# EasyEDA Pro project SAM-2.eprj, board SAM-25
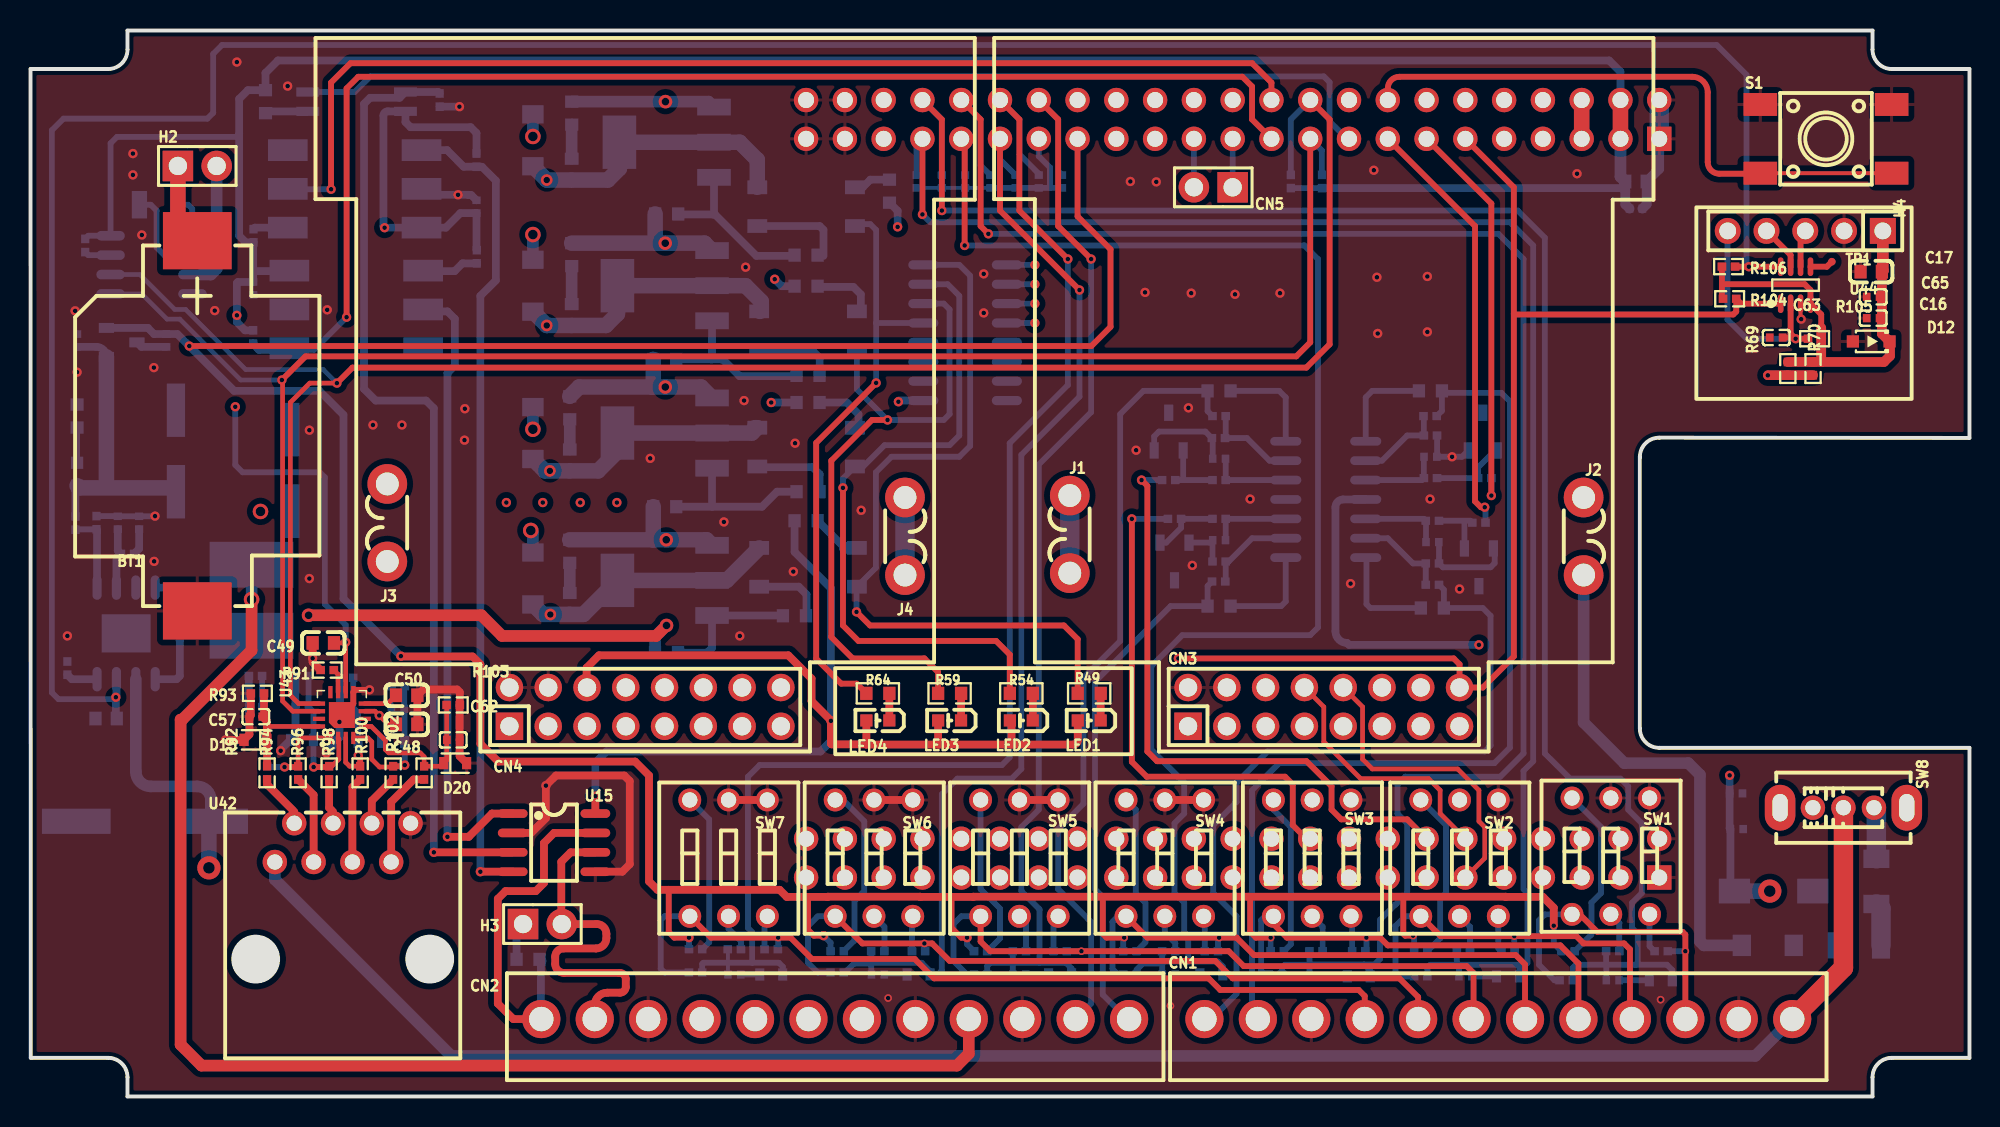
[diagram p20: board, top side]
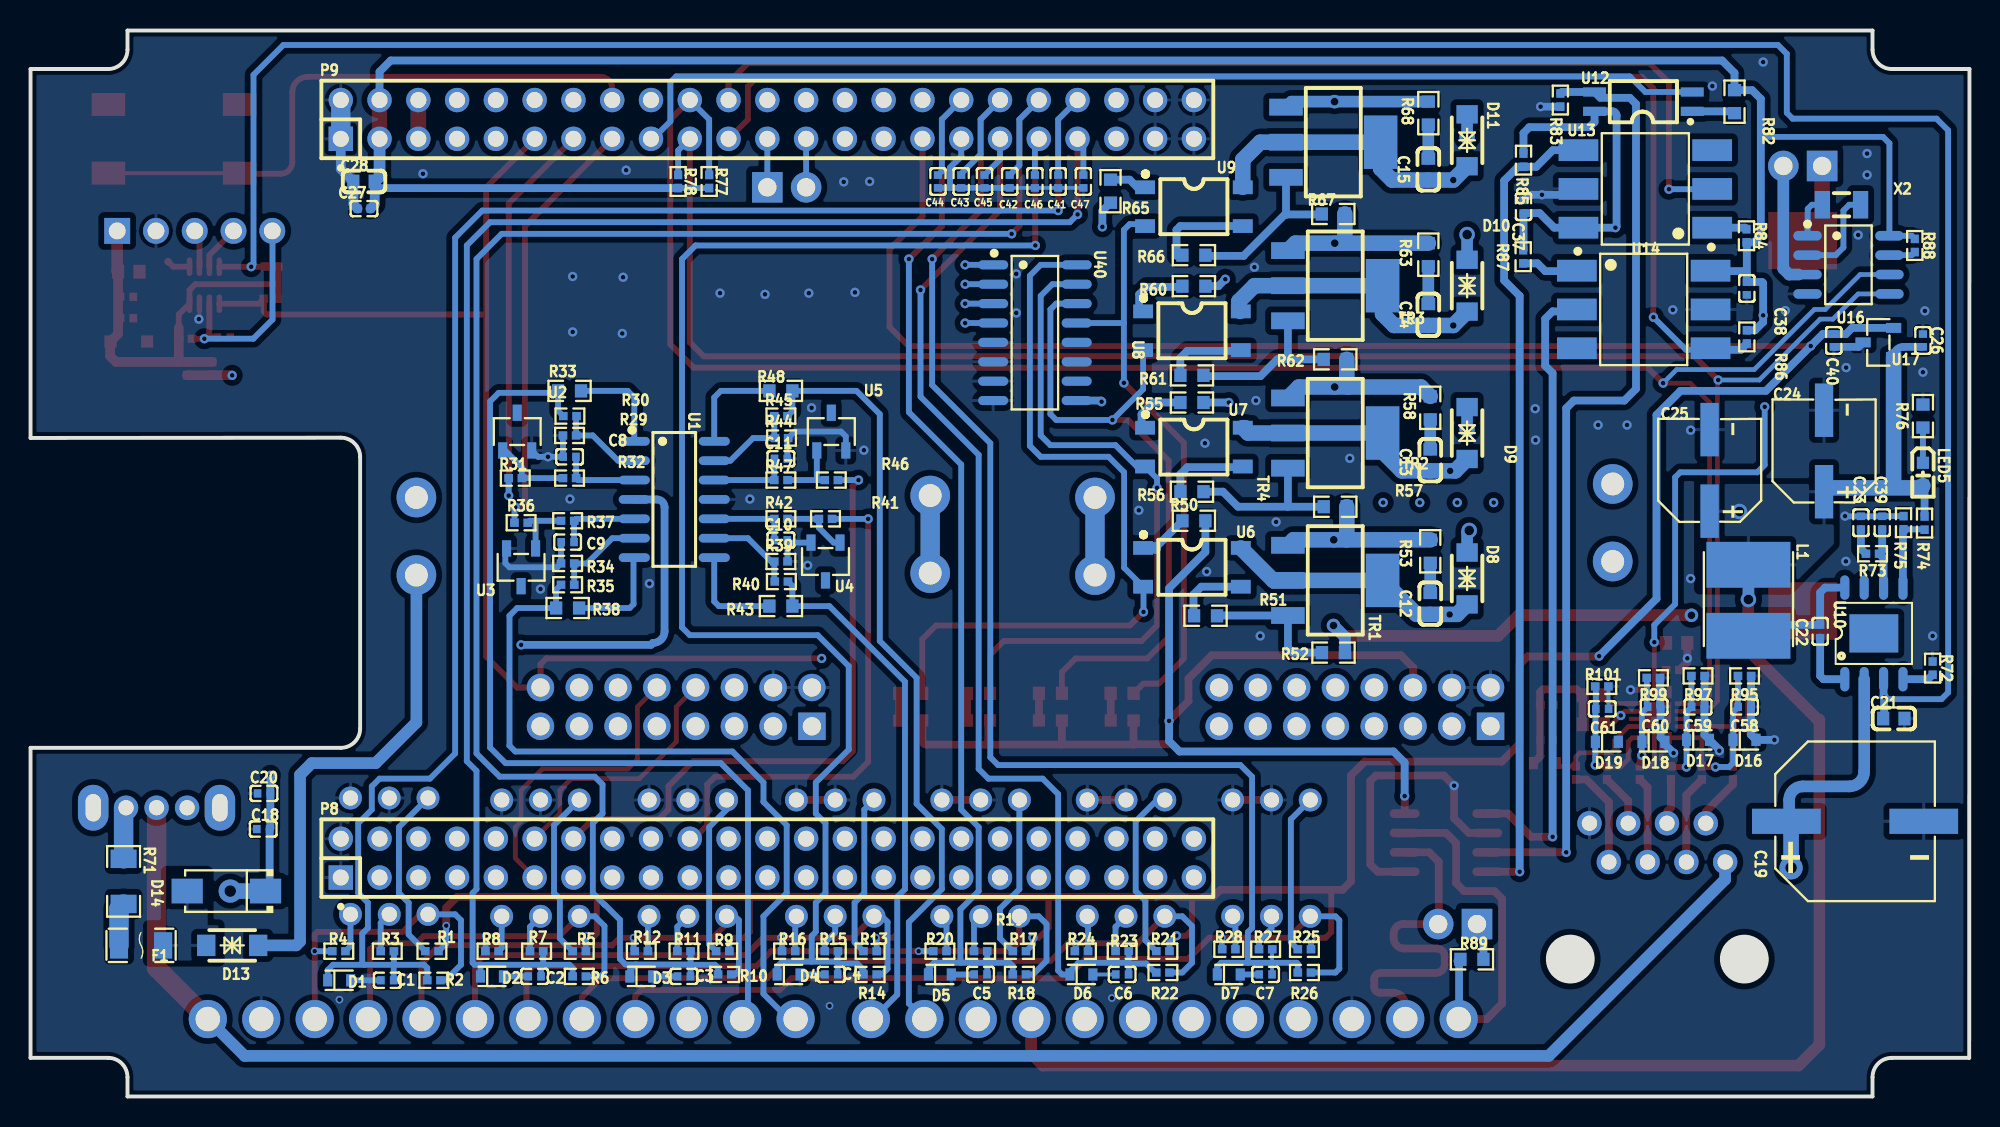
[diagram p21: board, bottom side, seen from below]

Outline 127 x 69.82 mm; copper layers: Top Layer, Inner1, Inner2, Bottom Layer. Coordinates in mm from the lower left corner of the outline.
Outline path: 0,67.3 0.02,2.53 5.08,2.53 arc(5.98,2.16) 6.35,1.26 6.35,0 120.65,0 120.65,1.26 arc(121.02,2.16) 121.92,2.53 127,2.53 127,22.84 106.68,22.84 arc(105.78,23.21) 105.41,24.11 105.41,41.88 arc(105.78,42.78) 106.68,43.15 127,43.14 127,67.3 121.92,67.3 arc(121.02,67.67) 120.65,68.57 120.65,69.82 6.35,69.82 6.35,68.57 arc(5.98,67.67) 5.08,67.3 0,67.3
Stack: Top Layer 0.035mm Outer layer thickness 1oz / Dielectric1 0.2104mm 7628 RC49% 8.6mil / Inner1 0.0152mm Inner layer thickness / Dielectric2 1.065mm 1.1mm H/HOZ Copper / Inner2 0.0152mm Inner layer thickness / Dielectric3 0.2104mm 7628 RC49% 8.6mil / Bottom Layer 0.035mm Outer layer thickness 1oz

## Design rules (mm)
net B+: DP1
net B-: DP1
template: Custom Config
spacing copperThickness1oz (default): track to track 0.102, other pairs 0.152 to 0.3
spacing copperThickness2oz: track to track 0.203, other pairs 0.152 to 0.3
spacing copperThicknessInner0.5oz: track to track 0.089, other pairs 0.152 to 0.3
track width copperThickness1oz (default): min 0.102, default 0.254, max 2.54
track width copperThickness2oz: min 0.203, default 0.254, max 2.54
track width copperThickness0.5oz: min 0.089, default 0.254, max 2.54
differential pair differentialPair (default): width min 0.127, default 0.254, max 2.54; gap min 0.152, default 0.152
via viaSize (default): diameter min 0.3, default 0.61, max 10; hole min 0.2, default 0.305, max 6.3

## Placement (name value [footprint] x y rotation side)
BT1  BS-16-B4AK003  [BAT-SMD_BS-16-B4AK005]  10.92 43.93 90 top
C1  100nF  [C0402]  103.63 7.61 180 bottom
C2  100nF  [C0402]  93.98 7.86 180 bottom
C3  100nF  [C0402]  84.2 7.86 180 bottom
C4  100nF  [C0402]  74.55 7.99 180 bottom
C5  100nF  [C0402]  64.77 7.99 180 bottom
C6  100nF  [C0402]  55.5 7.99 180 bottom
C7  100nF  [C0402]  46.1 7.99 180 bottom
C8  10uF  [C0402]  91.69 41.9 180 bottom
C9  10uF  [C0402]  91.82 36.31 180 bottom
C10  10uF  [C0402]  77.85 36.44 0 bottom
C11  10uF  [C0402]  77.85 41.77 0 bottom
C12  10nF  [C0603]  35.32 32.28 270 bottom
C13  10nF  [C0603]  35.32 41.68 270 bottom
C14  10nF  [C0603]  35.44 51.2 270 bottom
C15  10nF  [C0603]  35.44 60.73 270 bottom
C16  100nF  [C0402]  120.69 50.98 0 top
C17  1uF  [C0603]  120.56 54.03 0 top
C18  220nF  [C0402]  111.76 17.52 180 bottom
C19  330uF  [CAP-SMD_BD10.0-L10.3-W10.3-LS11.3-FD]  7.49 18.02 180 bottom
C20  100nF  [C0402]  111.71 19.85 180 bottom
C21  1uF  [C0603]  4.95 24.76 0 bottom
C22  100nF  [C0402]  9.78 30.47 270 bottom
C23  3.3nF  [C0402]  7.11 37.58 270 bottom
C24  220uF  [CAP-SMD_BD6.3-L6.6-W6.6-FD]  9.53 42.28 90 bottom
C25  220uF  [CAP-SMD_BD6.3-L6.6-W6.6-FD]  17.02 41.01 90 bottom
C26  100nF  [C0402]  3.05 49.52 270 bottom
C27  100nF  [C0402]  105.16 58.16 180 bottom
C28  10uF  [C0603]  105.16 59.93 180 bottom
C37  100nF  [C0402]  29.21 58.28 270 bottom
C38  100nF  [C0402]  14.58 52.93 90 bottom
C39  47pF  [C0402]  5.72 37.58 270 bottom
C40  2.2uF  [C0402]  8.89 49.52 90 bottom
C41  100nF  [C0402]  59.69 59.93 90 bottom
C42  100nF  [C0402]  62.87 59.93 90 bottom
C43  100nF  [C0402]  66.04 59.93 90 bottom
C44  100nF  [C0402]  67.56 59.93 90 bottom
C45  100nF  [C0402]  64.52 59.93 90 bottom
C46  100nF  [C0402]  61.21 59.93 90 bottom
C47  100nF  [C0402]  58.04 59.93 90 bottom
C48  1uF  [C0603]  24.64 24.37 180 top
C49  1uF  [C0603]  19.18 29.71 0 top
C50  1uF  [C0603]  24.64 26.28 180 top
C57  100nF  [C0402]  14.76 24.88 0 top
C58  100nF  [C0402]  14.73 25.52 0 bottom
C59  100nF  [C0402]  17.78 25.52 0 bottom
C60  100nF  [C0402]  20.65 25.52 0 bottom
C61  100nF  [C0402]  24.05 25.39 0 bottom
C62  100nF  [C0402]  27.69 23.36 180 top
C63  100nF  [C0402]  114.34 49.71 180 top
C65  2.2uF  [C0402]  120.69 52.38 0 top
CN1  KF2EDGV-3.5-12P  [CONN-TH_12P-P3.50_KF2EDGV-3.5-12P]  96.14 5.07 0 top
CN2  KF2EDGV-3.5-12P  [CONN-TH_12P-P3.50_KF2EDGV-3.5-12P]  52.71 5.07 0 top
CN3  PZ254V-12-16P  [HDR-TH_16P-P2.54-V-M-R2-C8-S2.54]  84.71 25.52 0 top
CN4  PZ254V-12-16P  [HDR-TH_16P-P2.54-V-M-R2-C8-S2.54]  40.26 25.52 0 top
CN5  JP2  [HDR-TH_2P-P2.54-V-M]  77.47 59.55 180 top
D1  CDBU00340-HF  [SOD-523F_L1.7-W0.9-LS1.7-RD]  106.78 7.61 180 bottom
D2  CDBU00340-HF  [SOD-523F_L1.7-W0.9-LS1.7-RD]  96.77 7.86 180 bottom
D3  CDBU00340-HF  [SOD-523F_L1.7-W0.9-LS1.7-RD]  87 7.86 180 bottom
D4  CDBU00340-HF  [SOD-523F_L1.7-W0.9-LS1.7-RD]  77.34 7.99 180 bottom
D5  CDBU00340-HF  [SOD-523F_L1.7-W0.9-LS1.7-RD]  67.44 7.99 180 bottom
D6  CDBU00340-HF  [SOD-523F_L1.7-W0.9-LS1.7-RD]  58.17 7.99 180 bottom
D7  CDBU00340-HF  [SOD-523F_L1.7-W0.9-LS1.7-RD]  48.51 7.99 180 bottom
D8  SMF60CA  [SOD-123FL_L2.8-W1.8-LS3.7-BI]  32.91 33.93 270 bottom
D9  SMF60CA  [SOD-123FL_L2.8-W1.8-LS3.7-BI]  32.91 43.46 270 bottom
D10  SMF60CA  [SOD-123FL_L2.8-W1.8-LS3.7-BI]  32.91 53.11 270 bottom
D11  SMF60CA  [SOD-123FL_L2.8-W1.8-LS3.7-BI]  32.91 62.63 270 bottom
D12  MM3Z3V3ST1G  [SOD-323_L1.7-W1.3-LS2.5-RD]  120.56 49.46 180 top
D13  SMF60CA  [SOD-123FL_L2.8-W1.8-LS3.7-BI]  113.79 9.9 0 bottom
D14  ES1B-13-F  [SMA_L4.4-W2.8-LS5.4-RD]  114.17 13.45 0 bottom
D15  CDBU00340-HF  [SOD-523F_L1.7-W0.9-LS1.7-RD]  14.73 23.36 180 top
D16  CDBU00340-HF  [SOD-523F_L1.7-W0.9-LS1.7-RD]  14.73 23.36 180 bottom
D17  CDBU00340-HF  [SOD-523F_L1.7-W0.9-LS1.7-RD]  17.78 23.36 180 bottom
D18  CDBU00340-HF  [SOD-523F_L1.7-W0.9-LS1.7-RD]  20.7 23.23 180 bottom
D19  CDBU00340-HF  [SOD-523F_L1.7-W0.9-LS1.7-RD]  23.75 23.23 180 bottom
D20  CDBU00340-HF  [SOD-523F_L1.7-W0.9-LS1.7-RD]  27.81 21.83 0 top
F1  0466.500NRHF  [F1206]  119.76 9.9 180 bottom
H2  PZ254V-11-02P  [HDR-TH_2P-P2.54-V-M]  10.92 60.95 0 top
H3  PZ254V-11-02P  [HDR-TH_2P-P2.54-V-M]  33.53 11.29 0 top
H4  PZ254V-11-05P  [HDR-TH_5P-P2.54-V-M]  116.25 56.7 180 top
J1  3551  [CONN-TH_3551]  68.07 36.82 90 top
J2  3551  [CONN-TH_3551]  101.73 36.69 270 top
J3  3551  [CONN-TH_3551]  23.37 37.58 90 top
J4  3551  [CONN-TH_3551]  57.28 36.69 270 top
L1  6.8uH  [IND-SMD_L5.8-W5.2]  14.48 32.5 270 bottom
LED1  KT-0603R  [LED-SMD_L1.6-W0.8-R-RD]  69.34 24.63 180 top
LED2  KT-0603R  [LED-SMD_L1.6-W0.8-R-RD]  64.9 24.63 180 top
LED3  KT-0603R  [LED-SMD_L1.6-W0.8-R-RD]  60.2 24.63 180 top
LED4  KT-0603R  [LED-SMD_L1.6-W0.8-R-RD]  55.5 24.63 180 top
LED5  KT-0603R  [LED-SMD_L1.6-W0.8-R-RD]  3.05 40.76 270 bottom
P8  X6521WV-2x23H-C60D30  [HDR-TH_46P-2.54-V-M-R2-C23-S2.54]  78.74 15.61 180 bottom
P9  X6521WV-2x23H-C60D30  [HDR-TH_46P-2.54-V-M-R2-C23-S2.54]  78.74 64 180 bottom
R1  10kΩ  [R0402]  100.71 9.52 180 bottom
R2  10kΩ  [R0402]  100.58 7.61 180 bottom
R3  2.2kΩ  [R0402]  103.63 9.52 0 bottom
R4  90.9Ω  [R0402]  106.81 9.52 0 bottom
R5  10kΩ  [R0402]  91.06 9.52 180 bottom
R6  10kΩ  [R0402]  91.06 7.86 180 bottom
R7  2.2kΩ  [R0402]  93.85 9.52 0 bottom
R8  90.9Ω  [R0402]  96.77 9.52 0 bottom
R9  10kΩ  [R0402]  81.66 9.52 180 bottom
R10  10kΩ  [R0402]  81.53 7.99 180 bottom
R11  2.2kΩ  [R0402]  84.2 9.52 0 bottom
R12  90.9Ω  [R0402]  87 9.52 0 bottom
R13  10kΩ  [R0402]  72.01 9.52 180 bottom
R14  10kΩ  [R0402]  72.01 7.99 180 bottom
R15  2.2kΩ  [R0402]  74.55 9.52 0 bottom
R16  90.9Ω  [R0402]  77.34 9.52 0 bottom
R17  10kΩ  [R0402]  62.23 9.52 180 bottom
R18  10kΩ  [R0402]  62.23 7.99 180 bottom
R19  2.2kΩ  [R0402]  64.77 9.52 0 bottom
R20  90.9Ω  [R0402]  67.44 9.52 0 bottom
R21  10kΩ  [R0402]  52.83 9.52 180 bottom
R22  10kΩ  [R0402]  52.83 8.12 180 bottom
R23  2.2kΩ  [R0402]  55.5 9.52 0 bottom
R24  90.9Ω  [R0402]  58.17 9.52 0 bottom
R25  10kΩ  [R0402]  43.56 9.64 180 bottom
R26  10kΩ  [R0402]  43.56 8.12 180 bottom
R27  2.2kΩ  [R0402]  46.1 9.64 0 bottom
R28  90.9Ω  [R0402]  48.51 9.64 0 bottom
R29  10kΩ  [R0402]  91.69 43.3 180 bottom
R30  71.5kΩ  [R0402]  91.67 44.57 0 bottom
R31  1kΩ  [R0402]  95.25 40.5 180 bottom
R32  100kΩ  [R0402]  91.69 40.5 180 bottom
R33  50Ω  [R0603]  91.69 46.22 180 bottom
R34  10kΩ  [R0402]  91.82 34.92 180 bottom
R35  71.5kΩ  [R0402]  91.82 33.52 0 bottom
R36  1kΩ  [R0402]  94.87 37.58 180 bottom
R37  100kΩ  [R0402]  91.82 37.71 180 bottom
R38  50Ω  [R0603]  91.82 31.99 180 bottom
R39  10kΩ  [R0402]  77.85 35.04 0 bottom
R40  71.5kΩ  [R0402]  77.82 33.73 180 bottom
R41  1kΩ  [R0402]  74.93 37.84 0 bottom
R42  100kΩ  [R0402]  77.85 37.84 0 bottom
R43  50Ω  [R0603]  77.85 32.12 0 bottom
R44  10kΩ  [R0402]  77.81 43.13 0 bottom
R45  71.5kΩ  [R0402]  77.85 44.57 180 bottom
R46  1kΩ  [R0402]  74.55 40.38 0 bottom
R47  100kΩ  [R0402]  77.85 40.38 0 bottom
R48  50Ω  [R0603]  77.85 46.22 0 bottom
R49  470Ω  [R0603]  69.34 26.41 0 top
R50  330Ω  [R0603]  50.8 37.71 180 bottom
R51  220Ω  [R0603]  50.04 31.49 180 bottom
R52  1kΩ  [R0603]  41.66 29.07 0 bottom
R53  100Ω  [R0603]  35.32 35.71 270 bottom
R54  470Ω  [R0603]  64.9 26.41 0 top
R55  330Ω  [R0603]  50.93 45.46 180 bottom
R56  220Ω  [R0603]  50.93 39.61 180 bottom
R57  1kΩ  [R0603]  41.54 38.63 0 bottom
R58  100Ω  [R0603]  35.32 45.11 270 bottom
R59  470Ω  [R0603]  60.2 26.41 0 top
R60  330Ω  [R0603]  50.8 53.08 180 bottom
R61  220Ω  [R0603]  50.93 47.23 180 bottom
R62  1kΩ  [R0603]  41.54 48.28 0 bottom
R63  100Ω  [R0603]  35.44 55.14 270 bottom
R64  470Ω  [R0603]  55.5 26.41 0 top
R65  330Ω  [R0603]  56.26 59.3 270 bottom
R66  220Ω  [R0603]  50.8 55.11 180 bottom
R67  1kΩ  [R0603]  41.67 57.81 0 bottom
R68  100Ω  [R0603]  35.44 64.41 270 bottom
R69  6.8kΩ  [R0402]  115.1 47.68 270 top
R70  6.8kΩ  [R0402]  116.75 47.68 270 top
R71  0Ω  [R1206]  120.9 14.09 270 bottom
R72  200kΩ  [R0402]  2.41 28.06 270 bottom
R73  14kΩ  [R0402]  6.35 35.55 180 bottom
R74  115kΩ  [R0402]  2.94 37.56 90 bottom
R75  22kΩ  [R0402]  4.32 37.58 270 bottom
R76  470Ω  [R0603]  3.05 44.57 270 bottom
R77  4.7kΩ  [R0402]  82.55 59.93 270 bottom
R78  4.7kΩ  [R0402]  84.58 59.93 270 bottom
R82  470Ω  [R0603]  15.39 65.16 90 bottom
R83  1kΩ  [R0402]  26.8 65.27 90 bottom
R84  1kΩ  [R0402]  14.61 56.38 270 bottom
R85  1kΩ  [R0402]  29.21 61.33 90 bottom
R86  1kΩ  [R0402]  14.58 49.75 90 bottom
R87  1kΩ  [R0402]  29.23 55 270 bottom
R88  4.7kΩ  [R0402]  3.58 55.74 90 bottom
R89  120Ω  [R0603]  32.59 8.98 0 bottom
R91  100kΩ  [R0402]  19.43 27.93 0 top
R92  10kΩ  [R0402]  15.49 21.2 270 top
R93  4.7kΩ  [R0402]  14.86 26.41 0 top
R94  10kΩ  [R0402]  17.53 21.2 270 top
R95  4.7kΩ  [R0402]  14.73 27.55 0 bottom
R96  10kΩ  [R0402]  19.56 21.2 270 top
R97  4.7kΩ  [R0402]  17.78 27.55 0 bottom
R98  10kΩ  [R0402]  21.59 21.2 270 top
R99  4.7kΩ  [R0402]  20.7 27.42 0 bottom
R100  10kΩ  [R0402]  23.75 21.2 270 top
R101  4.7kΩ  [R0402]  24.08 26.86 0 bottom
R102  10kΩ  [R0402]  25.78 21.2 270 top
R103  4.7kΩ  [R0402]  27.69 25.64 180 top
R104  33kΩ  [R0402]  111.29 52.25 180 top
R105  33kΩ  [R0402]  116.86 49.64 0 top
R106  33kΩ  [R0402]  111.22 54.36 180 top
S1  RESET  [KEY-SMD_4P-L6.0-W6.0-P4.50-LS8.6]  117.6 62.73 0 top
SW1  SMQS-03R-TP  [SW-TH_SMQS-03B-TP]  103.5 15.74 0 top
SW2  SMQS-03R-TP  [SW-TH_SMQS-03B-TP]  93.6 15.61 0 top
SW3  SMQS-03R-TP  [SW-TH_SMQS-03B-TP]  83.95 15.61 0 top
SW4  SMQS-03R-TP  [SW-TH_SMQS-03B-TP]  74.29 15.61 0 top
SW5  SMQS-03R-TP  [SW-TH_SMQS-03B-TP]  64.77 15.61 0 top
SW6  SMQS-03R-TP  [SW-TH_SMQS-03B-TP]  55.25 15.61 0 top
SW7  SMQS-03R-TP  [SW-TH_SMQS-03B-TP]  45.72 15.61 0 top
SW8  SS12D07VG4 087  [SW-TH_SS12D07VG4]  118.75 18.91 0 top
TP1  -  [Test-Point-0.5mm]  117.99 54.68 180 top
TR1  Z0107MN 5AA4  [SOT-223_L6.7-W3.5-P2.30-BR]  41.54 33.8 0 bottom
TR2  Z0107MN 5AA4  [SOT-223_L6.7-W3.5-P2.30-BR]  41.54 43.46 0 bottom
TR3  Z0107MN 5AA4  [SOT-223_L6.7-W3.5-P2.30-BR]  41.54 53.11 0 bottom
TR4  Z0107MN 5AA4  [SOT-223_L6.7-W3.5-P2.30-BR]  41.67 62.51 0 bottom
U1  MC33174DR2G  [SOIC-14_L8.7-W3.9-P1.27-LS6.0-BL]  84.84 39.11 270 bottom
U2  LM4041C12IDBZR  [SOT-23-3_L2.9-W1.6-P1.90-LS2.8-BR]  95.12 43.55 270 bottom
U3  LM4041C12IDBZR  [SOT-23-3_L2.9-W1.6-P1.90-LS2.8-BR]  94.87 34.66 90 bottom
U4  LM4041C12IDBZR  [SOT-23-3_L2.9-W1.6-P1.90-LS2.8-BR]  74.93 35.04 90 bottom
U5  LM4041C12IDBZR  [SOT-23-3_L2.9-W1.6-P1.90-LS2.8-BR]  74.55 43.55 270 bottom
U6  CTM3053(T1)  [SOP-4_L3.6-W4.4-P2.54-LS7.0-TL]  50.93 34.66 180 bottom
U7  CTM3053(T1)  [SOP-4_L3.6-W4.4-P2.54-LS7.0-TL]  50.8 42.54 180 bottom
U8  CTM3053(T1)  [SOP-4_L3.6-W4.4-P2.54-LS7.0-TL]  50.93 50.16 180 bottom
U9  CTM3053(T1)  [SOP-4_L3.6-W4.4-P2.54-LS7.0-TL]  50.8 58.28 180 bottom
U10  AP64350SP-13  [SO-8_L4.9-W3.9-P1.27-LS6.0-BL-EP]  6.26 30.33 180 bottom
U12  HMHA2801R2  [SMD-4_L2.7-W4.4-P1.27-LS7.0-BL]  21.36 65.16 90 bottom
U13  H11L1S(TA)  [SMD-6_L7.3-W6.5-P2.54-LS10.2-BL]  21.23 59.45 90 bottom
U14  H11L1S(TA)  [SMD-6_L7.3-W6.5-P2.54-LS10.2-BL]  21.34 51.55 270 bottom
U15  SP485EEN-L/TR  [SOIC-8_L5.0-W4.0-P1.27-LS6.0-BL]  34.29 16.63 270 top
U16  DS1307DTR(XBLW)  [SOP-8_L4.9-W3.9-P1.27-LS6.0-BL]  7.92 54.47 270 bottom
U17  AP7313-18SAG-7  [SOT-23-3_L2.9-W1.3-P1.90-LS2.4-BR]  5.97 49.39 180 bottom
U40  ULN2003ADR  [SOIC-16_L9.9-W3.9-P1.27-LS6.0-BL]  61.21 50.03 270 bottom
U42  HC-RJ45-5224-1-6  [RJ45-TH_HCTL_HC-RJ45-5224-1-6]  20.45 16.63 0 top
U43  TLA2528IRTER  [WQFN-16_L3.0-W3.0-P0.50-TL-EP1.7]  20.39 24.99 90 top
U44  MSPM0C1103SDDFR  [TSOT-23-8_L2.9-W1.6-P0.65-LS2.8-BR]  115.61 53.14 270 top
X2  32.768kHz  [FC-135R_L3.2-W1.5]  8.38 58.41 0 bottom

## Footprints (pads in the part's own frame, mm; a bottom-side part is the same pattern mirrored in y, then rotated)
BAT-SMD_BS-16-B4AK005
  rect 3.75x4.5 smd: 1(12.125,0) 2(-12.125,0)
C0402
  rect 0.5x0.54 smd: 1(-0.42,0) 2(0.42,0)
C0603
  rect 0.8x0.9 smd: 1(-0.7,0) 2(0.7,0)
CAP-SMD_BD6.3-L6.6-W6.6-FD
  rect 3.5x1.2 smd: 1(-2.67,0) 2(2.67,0)
CAP-SMD_BD10.0-L10.3-W10.3-LS11.3-FD
  rect 4.5x1.65 smd: 1(-4.5,0) 2(4.5,0)
CONN-TH_12P-P3.50_KF2EDGV-3.5-12P
  round 2.5 hole 1.6: 1(-19.25,0) 2(-15.75,0) 3(-12.25,0) 4(-8.75,0) 5(-5.25,0) 6(-1.75,0) 7(1.75,0) 8(5.25,0) 9(8.75,0) 10(12.25,0) 11(15.75,0) 12(19.25,0)
CONN-TH_3551
  round 2.6 hole 1.5: 1(-2.54,0) 1(2.54,0)
F1206
  rect 1.19x1.728 smd: 1(-1.445,0) 2(1.445,0)
FC-135R_L3.2-W1.5
  rect 1x1.8 smd: 1(-1.25,0) 2(1.25,0)
HDR-TH_2P-P2.54-V-M
  rect 2x2 hole 1.2: 1(-1.27,0)
  round 2 hole 1.2: 2(1.27,0)
HDR-TH_5P-P2.54-V-M
  rect 1.7x1.7 hole 1.1: 1(-5.08,0)
  round 1.7 hole 1.1: 2(-2.54,0) 3(0,0) 4(2.54,0) 5(5.08,0)
HDR-TH_16P-P2.54-V-M-R2-C8-S2.54
  rect 1.8x1.8 hole 1.2: 1(-8.89,-1.27)
  round 1.8 hole 1.2: 2(-8.89,1.27) 3(-6.35,-1.27) 4(-6.35,1.27) 5(-3.81,-1.27) 6(-3.81,1.27) 7(-1.27,-1.27) 8(-1.27,1.27) 9(1.27,-1.27) 10(1.27,1.27) 11(3.81,-1.27) 12(3.81,1.27) 13(6.35,-1.27) 14(6.35,1.27) 15(8.89,-1.27) 16(8.89,1.27)
HDR-TH_46P-2.54-V-M-R2-C23-S2.54
  rect 1.6x1.6 hole 1.05: 1(-27.94,-1.27)
  round 1.6 hole 1.05: 2(-27.94,1.27) 3(-25.4,-1.27) 4(-25.4,1.27) 5(-22.86,-1.27) 6(-22.86,1.27) 7(-20.32,-1.27) 8(-20.32,1.27) 9(-17.78,-1.27) 10(-17.78,1.27) 11(-15.24,-1.27) 12(-15.24,1.27) 13(-12.7,-1.27) 14(-12.7,1.27) 15(-10.16,-1.27) 16(-10.16,1.27) 17(-7.62,-1.27) 18(-7.62,1.27) 19(-5.08,-1.27) 20(-5.08,1.27) 21(-2.54,-1.27) 22(-2.54,1.27) 23(0,-1.27) 24(0,1.27) 25(2.54,-1.27) 26(2.54,1.27) 27(5.08,-1.27) 28(5.08,1.27) 29(7.62,-1.27) 30(7.62,1.27) 31(10.16,-1.27) 32(10.16,1.27) 33(12.7,-1.27) 34(12.7,1.27) 35(15.24,-1.27) 36(15.24,1.27) 37(17.78,-1.27) 38(17.78,1.27) 39(20.32,-1.27) 40(20.32,1.27) 41(22.86,-1.27) 42(22.86,1.27) 43(25.4,-1.27) 44(25.4,1.27) 45(27.94,-1.27) 46(27.94,1.27)
IND-SMD_L5.8-W5.2
  rect 3x5.5 smd: 1(2.325,0) 2(-2.325,0)
KEY-SMD_4P-L6.0-W6.0-P4.50-LS8.6
  rect 2.2x1.5 smd: 1(-4.3,2.25) 2(4.3,2.25) 3(-4.3,-2.25) 4(4.3,-2.25)
LED-SMD_L1.6-W0.8-R-RD
  rect 0.8x0.8 smd: 1(0.75,0) 2(-0.75,0)
R0402
  rect 0.566x0.54 smd: 1(-0.433,0) 2(0.433,0)
R0603
  rect 0.806x0.864 smd: 1(-0.753,0) 2(0.753,0)
R1206
  rect 1.208x1.701 smd: 1(-1.479,0) 2(1.479,0)
RJ45-TH_HCTL_HC-RJ45-5224-1-6
  round 1.6 hole 1: 1(-4.445,-1.27) 2(-3.175,1.27) 3(-1.905,-1.27) 4(-0.635,1.27) 5(0.635,-1.27) 6(1.905,1.27) 7(3.175,-1.27) 8(4.445,1.27)
SMA_L4.4-W2.8-LS5.4-RD
  rect 2.046x1.62 smd: 1(-2.566,0) 2(2.566,0)
SMD-4_L2.7-W4.4-P1.27-LS7.0-BL
  rect 0.6x1.5 smd: 1(-0.635,-3.2) 2(0.635,-3.2) 3(0.635,3.2) 4(-0.635,3.2)
SMD-6_L7.3-W6.5-P2.54-LS10.2-BL
  rect 1.423x2.6 smd: 1(-2.54,-4.38) 2(0,-4.38) 3(2.54,-4.38) 4(2.54,4.38) 5(0,4.38) 6(-2.54,4.38)
SO-8_L4.9-W3.9-P1.27-LS6.0-BL-EP
  oval 0.6x1.6 smd: 1(-1.905,-3) 2(-0.635,-3) 3(0.635,-3) 4(1.905,-3) 5(1.905,3) 6(0.635,3) 7(-0.635,3) 8(-1.905,3)
  rect 3.2x2.5 smd: 9(0,0)
SOD-123FL_L2.8-W1.8-LS3.7-BI
  rect 1.2x1.4 smd: 1(-1.7,0) 2(1.7,0)
SOD-323_L1.7-W1.3-LS2.5-RD
  rect 0.8x0.8 smd: 1(-1.2,0) 2(1.2,0)
SOD-523F_L1.7-W0.9-LS1.7-RD
  rect 0.6x0.8 smd: 1(-0.75,0) 2(0.75,0)
SOIC-8_L5.0-W4.0-P1.27-LS6.0-BL
  oval 0.569x1.95 smd: 1(-1.905,-2.705) 2(-0.635,-2.705) 3(0.635,-2.705) 4(1.905,-2.705) 5(1.905,2.705) 6(0.635,2.705) 7(-0.635,2.705) 8(-1.905,2.705)
SOIC-14_L8.7-W3.9-P1.27-LS6.0-BL
  oval 0.574x2.038 smd: 1(-3.81,-2.619) 2(-2.54,-2.619) 3(-1.27,-2.619) 4(0,-2.619) 5(1.27,-2.619) 6(2.54,-2.619) 7(3.81,-2.619) 8(3.81,2.619) 9(2.54,2.619) 10(1.27,2.619) 11(0,2.619) 12(-1.27,2.619) 13(-2.54,2.619) 14(-3.81,2.619)
SOIC-16_L9.9-W3.9-P1.27-LS6.0-BL
  oval 0.602x1.971 smd: 1(-4.445,-2.736) 2(-3.175,-2.736) 3(-1.905,-2.736) 4(-0.635,-2.736) 5(0.635,-2.736) 6(1.905,-2.736) 7(3.175,-2.736) 8(4.445,-2.736) 9(4.445,2.736) 10(3.175,2.736) 11(1.905,2.736) 12(0.635,2.736) 13(-0.635,2.736) 14(-1.905,2.736) 15(-3.175,2.736) 16(-4.445,2.736)
SOP-4_L3.6-W4.4-P2.54-LS7.0-TL
  rect 1.3x0.9 smd: 1(-3.2,1.27) 2(-3.2,-1.27) 3(3.2,-1.27) 4(3.2,1.27)
SOP-8_L4.9-W3.9-P1.27-LS6.0-BL
  oval 0.63x1.865 smd: 1(-1.905,-2.683) 2(-0.635,-2.683) 3(0.635,-2.683) 4(1.905,-2.683) 5(1.905,2.683) 6(0.635,2.683) 7(-0.635,2.683) 8(-1.905,2.683)
SOT-23-3_L2.9-W1.3-P1.90-LS2.4-BR
  rect 1x0.65 smd: 1(1,-0.95) 2(1,0.95) 3(-1,0)
SOT-23-3_L2.9-W1.6-P1.90-LS2.8-BR
  rect 1.07x0.6 smd: 1(1.235,-0.95) 2(1.235,0.95) 3(-1.235,0)
SOT-223_L6.7-W3.5-P2.30-BR
  rect 2.2x1.1 smd: 1(3.099,-2.3) 2(3.099,0) 3(3.099,2.3)
  rect 2.2x3.5 smd: 4(-3.099,0)
SW-TH_SMQS-03B-TP
  round 1.5 hole 1: 1(-2.54,-3.81) 2(0,-3.81) 3(2.54,-3.81) 4(2.54,3.81) 5(0,3.81) 6(-2.54,3.81)
SW-TH_SS12D07VG4
  oval 1.6x1.6 hole 1: 1(-2,0) 2(0,0) 3(2,0)
  oval 2x3 hole 1x1.8: 4(4.15,0) 5(-4.15,0)
Test-Point-0.5mm
  round 0.5 smd: 1(0,0)
TSOT-23-8_L2.9-W1.6-P0.65-LS2.8-BR
  oval 1.222x0.364 smd: 1(1.211,-0.975) 2(1.211,-0.325) 3(1.211,0.325) 4(1.211,0.975) 5(-1.211,0.975) 6(-1.211,0.325) 7(-1.211,-0.325) 8(-1.211,-0.975)
WQFN-16_L3.0-W3.0-P0.50-TL-EP1.7
  rect 0.8x0.28 smd: 1(-1.5,0.75) 2(-1.5,0.25) 3(-1.5,-0.25) 4(-1.5,-0.75) 9(1.5,-0.75) 10(1.5,-0.25) 11(1.5,0.25) 12(1.5,0.75)
  rect 0.28x0.8 smd: 5(-0.75,-1.5) 6(-0.25,-1.5) 7(0.25,-1.5) 8(0.75,-1.5) 13(0.75,1.5) 14(0.25,1.5) 15(-0.25,1.5) 16(-0.75,1.5)
  custom 1.7x1.7 smd: 17(0,0)

## Nets
As in the schematic.

Pads without a net: CN3 1 3 5 7 9 11 13 15; CN4 1 3 5 7 9 11 13 15; P8 3 4 5 6 19 21 22 23 24 26 27 28 29 30 31 32 33 34 35 36 37 38 39 40 41 42 43 44 45 46; P9 7 8 9 10 12 14 18 24 26 27 28 29 30 32 41 42; SW8 1 4 5; U2 3; U3 3; U4 3; U5 3; U10 9; U13 3; U14 3; U40 10 11 12; U43 6 12 15

## Via types
v1: diameter 0.61, hole 0.305, Top Layer to Bottom Layer, 116 vias
v2: diameter 0.762, hole 0.432, Top Layer to Bottom Layer, 4 vias
v3: diameter 1.524, hole 0.762, Top Layer to Bottom Layer, 2 vias
v4: diameter 1.016, hole 0.635, Top Layer to Bottom Layer, 6 vias
v5: diameter 0.5, hole 0.3, Top Layer to Bottom Layer, 14 vias
v6: diameter 0.889, hole 0.508, Top Layer to Bottom Layer, 6 vias

## Routing (per net, layer and track width the routed paths; a pad name or vN(x,y) marks a point on that pad's centre or on a via; arc(x,y) is an arc through that point)
3V3: length 191.7
  Top Layer w0.305: C49.2 20.6,29.71 v1(20.64,29.76) U43.10
  Top Layer w1.016: 104.14,65.27 104.14,62.73
  Inner2 w0.381: v1(13.41,45.18) 13.41,50.99 13.51,51.1 v1(13.51,51.17)
  Bottom Layer w0.381: v1(13.41,45.18) 13.41,41.37 13.89,40.88 18.95,40.88 19.28,40.55 19.28,32.25 20.64,30.88 v1(20.64,29.76) ; 13.67,63.05 13.47,62.86 5.66,62.86 5.24,62.43 U16.8 3.78,56.38 R88.2 ; R77.2 R78.2
  Bottom Layer w0.508: 14.58,53.91 C38.2 13.58,53.35 13.51,53.28 v1(13.51,51.17) 13.51,50.72 14.05,50.19 14.58,50.19 ; 14.58,53.91 14.74,54.06 16.93,54.06 16.96,54.09 ; 14.58,53.91 14.58,55.92 R84.2 14.1,55.95 13.67,56.38 13.67,65.34 14.24,65.92 R82.2 15.39,67.04 16.21,67.86 103.4,67.86 104.14,67.12 104.14,65.27 ; 104.46,59.28 104.23,59.5 R78.2
  Bottom Layer w0.635: 104.46,59.93 104.46,58.44 104.74,58.16
  Bottom Layer w0.762: 104.14,62.73 104.14,60.25 104.46,59.93
5V0: length 487.9
  Top Layer w0.305: C48.2 23.42,24.37 v1(22.84,24.96) 22.56,25.24 U43.7
  Top Layer w0.508: CN4.6 36.42,26.81 36.42,28.08 37.24,28.9 49.63,28.9 51.16,27.37 51.16,25.9 52.43,24.63 ; 64.26,23.05 59.48,23.05 ; 64.26,23.05 64.26,24.52 arc(64.22,24.6) LED2.1 ; 64.26,23.05 68.33,23.05 arc(68.51,23.13) 68.59,23.32 LED1.1 ; 59.48,23.05 54.74,23.05 arc(54.75,23.06) 54.75,23.07 ; 59.48,23.05 arc(59.46,23.06) 59.45,23.09 LED3.1 ; 52.47,24.48 52.43,24.53 52.43,23.11 52.47,23.07 54.75,23.07 ; U15.8 v1(37,19.68) ; LED4.1 54.75,23.07
  Top Layer w0.762: v4(14.48,32.55) 14.48,29.23 9.94,24.68 9.83,24.68 9.83,3.39 11.2,2.02 60.68,2.02 61.46,2.8 CN2.9
  Top Layer w1.016: 101.6,65.27 101.6,62.73
  Inner2 w0.305: v1(22.84,24.96) 22.84,32.17 22.45,32.55 v4(14.48,32.55)
  Inner2 w0.508: v1(23.19,56.91) 15.1,56.91 arc(15.07,56.9) 15.06,56.87 ; v1(56.79,56.96) 53.37,53.53 v1(48.74,53.53) 48.51,53.31 ; CN3.6 80.9,29.05 82.53,30.67 97.94,30.67 98.7,31.44 98.7,59.83 101.6,62.73 ; v1(48.51,45.46) 56.79,45.46 v1(56.85,45.51)
  Inner2 w0.635: 48.49,67.68 48.51,67.65 v1(48.51,45.46) 48.51,29.96 47.5,28.95 37.57,28.95 36.45,27.83 CN4.6
  Inner2 w1.016: 101.6,65.27 101.6,66.72 arc(101.32,67.4) 100.63,67.68 15.75,67.68 arc(15.26,67.48) 15.06,67 v4(15.06,38.32)
  Bottom Layer w0.508: v1(48.74,53.53) 49.2,53.08 R60.2 ; R85.2 29.21,63.11 28.83,63.49 24.89,63.49 24.56,63.83 24.56,64.53 23.39,64.53 arc(23.2,64.45) 23.11,64.25 23.11,56.98 arc(23.14,56.93) v1(23.19,56.91) U13.6 27.2,56.91 28.16,57.86 29.21,57.86 29.21,55.46 R87.1 ; R50.2 50.05,35.67 52.43,33.29 v1(52.43,24.6) 52.43,23.28 51.74,22.6 37.72,22.6 37,21.87 v1(37,19.68) ; 50.17,45.46 v1(48.51,45.46) ; 3.05,40.01 2.94,39.9 R74.2 ; R65.2 56.79,58.01 v1(56.79,56.96) ; U40.9 56.87,45.58 56.82,45.53 v1(56.85,45.51) ; C26.2 4.31,49.1 arc(4.78,48.91) 4.97,48.44
  Bottom Layer w0.762: L1.2 v4(14.48,32.55)
  Bottom Layer w1.016: 9.53,39.87 3.19,39.87 3.05,40.01 ; 4.97,48.44 4.97,40
24VAC: length 121.5
  Top Layer w1.27: CN1.12 118.75,8.43 SW8.2
  Bottom Layer w0.762: U42.1 16,14.21 27.56,2.66 112.98,2.66 CN1.12
24VAC_SW: length 271
  Top Layer w0.762: v6(18.21,31.52) 29.53,31.52 30.89,30.17 40.97,30.17 v6(41.66,30.85)
  Inner2 w0.762: v6(41.66,30.85) 41.64,30.87 v6(41.64,36.46) 41.64,65.16 ; v6(18.21,31.52) 16.37,31.52 14.66,29.81 11.51,29.81 9.98,28.29 9.98,3.32 arc(10.57,1.9) 11.99,1.31 117.65,1.31 arc(119.45,2.06) 120.19,3.85 120.19,18.36 arc(120.35,18.75) SW8.3
  Bottom Layer w0.762: TR4.1 44.41,65.16 v6(41.59,65.16) R68.1 ; v6(41.66,30.85) 40.9,30.1 R52.1
  Bottom Layer w1.016: 40.99,55.89 v6(41.57,55.89) 44.15,55.89 TR3.1 ; 40.99,55.89 35.44,55.89 ; 40.99,55.89 40.91,55.97 R67.1 ; 40.79,36.46 v6(41.64,36.46) 44.28,36.46 TR1.1 ; 40.79,36.46 R57.1 ; 40.79,36.46 R53.1 ; 40.7,46.47 v6(41.58,46.47) 43.92,46.47 TR2.1 ; 40.7,46.47 40.79,46.56 R62.1 ; 40.7,46.47 35.93,46.47 R58.1
  Bottom Layer w1.27: R71.1 120.9,18.75 SW8.3
24VURDC: length 233.9
  Top Layer w0.508: 113.8,47.25 arc(113.8,47.24) v1(113.79,47.23)
  Top Layer w0.635: 113.8,47.25 R69.2 R70.2
  Inner2 w0.508: v1(94.87,29.58) 104.22,29.58 arc(104.25,29.59) 104.27,29.62
  Inner2 w0.635: v1(111.29,21.03) 106.21,21.03 arc(104.84,21.6) 104.27,22.98 104.27,46.47 arc(104.49,47.01) 105.03,47.23 v1(113.79,47.23)
  Inner2 w1.016: v3(113.92,13.45) 117.73,13.45 arc(118.18,13.27) 118.36,12.82 118.36,3.42 arc(118.14,2.88) 117.6,2.66 12.95,2.66 arc(12.06,3.03) 11.68,3.93 v3(11.68,14.98)
  Bottom Layer w0.508: D14.1 111.34,13.72 C18.2 111.29,17.57 C20.2 v1(111.29,21.03) ; U1.4 85.98,39.11 arc(85.62,38.96) 85.47,38.6 85.47,30.47 arc(85.69,29.93) 86.23,29.71 86.36,29.58 v1(94.87,29.58)
  Bottom Layer w0.762: U10.2 6.9,21.29 arc(7.18,20.6) 7.87,20.31 10.92,20.31 arc(11.55,20.05) 11.81,19.42 11.81,17.97 arc(11.81,17.97) 11.81,17.97 arc(11.79,17.93) 11.76,17.91
  Bottom Layer w1.016: D14.1 v3(113.92,13.45) ; v3(11.68,14.98) 11.68,17.72 arc(11.7,17.82) 11.76,17.91
VBAT: length 5.4
  Top Layer w1.016: BT1.1 9.65,57.33 H2.1
VDD_WDT: length 28.4
  Top Layer w0.381: R104.2 110.78,52.33 110.78,53.2 ; 117.29,50.35 117.29,51.23 U44.4 116.59,52.82 116.21,53.2 110.78,53.2 ; 110.78,53.2 R106.2
  Top Layer w0.635: 117.31,48.11 117.29,48.14 117.29,50.35 ; 117.31,48.11 121.4,48.11 121.79,48.5 121.79,49.43 ; 117.31,48.11 R70.1 R69.1 ; C17.2 121.26,49.96 D12.1
  Top Layer w0.762: C17.2 121.33,54.09 H4.1
A01: length 62.4
  Bottom Layer w0.381: CN1.2 80.01,5.45 80.01,20.06 81.79,21.83 95.88,21.83 96.9,22.85 96.9,45.53 96.33,46.09 92.57,46.09 R33.1 92.45,44.91 R30.2
A02: length 49
  Bottom Layer w0.381: R35.2 92.57,33.2 R38.1 95.12,31.99 95.63,31.49 95.63,22.98 95.25,22.6 81.03,22.6 78.99,20.56 78.99,19.29 77.47,17.77 77.47,13.33 78.99,11.8 78.99,6.72 77.34,5.07 CN1.1
A03: length 34.3
  Bottom Layer w0.381: R40.2 77.1,33.44 77.1,32.12 74.68,32.12 69.72,27.17 69.72,13.58 70.23,13.07 70.23,6.67 71.83,5.07 CN2.12
A04: length 50.8
  Bottom Layer w0.381: CN2.11 69.47,6.08 69.47,11.42 67.31,13.58 67.31,17.52 68.96,19.17 68.96,27.42 71.37,29.84 71.37,44.69 72.9,46.22 77.1,46.22 77.1,44.89 R45.2
AIN1: length 8.4
  Top Layer w0.305: 15.48,24.19 15.52,24.24 U43.16
  Top Layer w0.508: R93.2 15.29,24.99 C57.2 15.48,24.58 D15.1 15.49,23.35 R92.1
AIN2: length 11.9
  Top Layer w0.305: R94.1 17.53,23.36 17.65,23.49 U43.1
  Top Layer w0.381: R94.1 17.47,21.58 v1(16.64,21.58)
  Bottom Layer w0.381: v1(16.64,21.58) 15.75,21.58 15.48,21.85 D16.1 15.48,25.19 15.15,25.52 15.17,25.53 R95.2
AIN3: length 9.4
  Top Layer w0.305: U43.2 20.19,23.43 20.19,22.09 19.74,21.63 R96.1
  Top Layer w0.381: v1(18.54,21.58) 19.51,21.58 R96.1
  Bottom Layer w0.381: R97.2 18.21,25.53 18.2,25.52 18.53,25.19 D17.1 18.53,21.59 v1(18.54,21.58)
AIN4: length 8.7
  Top Layer w0.305: R98.1 20.9,21.63 20.64,21.89 U43.3
  Top Layer w0.381: R98.1 21.59,22.22 v1(21.46,22.34)
  Bottom Layer w0.381: R99.2 21.13,25.58 C60.2 21.45,25.14 D18.1 21.46,23.22 v1(21.46,22.34)
AIN5: length 10.1
  Top Layer w0.305: R100.1 23.7,21.58 22.86,21.58 22.35,22.09 22.35,23.23 22.1,23.49 U43.4
  Top Layer w0.381: R100.1 24.44,21.63 v1(24.51,21.71)
  Bottom Layer w0.381: v1(24.51,21.71) 24.51,23.22 D19.1 24.5,25.37 C61.2 24.47,26.83 R101.2
AIN6: length 10.9
  Top Layer w0.305: R103.2 27.27,25.63 C62.2 27.27,22.04 D20.1 26.86,21.63 R102.1 25.78,22.25 25.53,22.51 23.46,22.51 23.24,22.72 23.24,23.32 22.32,24.24 U43.5
ANALOG_VDD: length 229.6
  Top Layer w0.381: 89.84,13.08 89.92,13.01 89.92,10.66 90.04,10.53 v5(90.56,10.53) ; v1(51.94,10.53) 51.31,10.53 50.93,10.91 50.93,13.01 50.99,13.07 ; 79.76,13.08 79.88,12.97 79.88,10.79 80.26,10.4 v5(81.23,10.4) ; P9.31 68.58,57.65 70.74,55.49 70.74,50.41 69.49,49.16 v1(10.4,49.16) ; v5(71.64,10.4) 70.49,10.4 70.23,10.66 70.23,13.05 70.2,13.08 ; v1(43.13,10.4) 42.16,10.4 41.8,10.77 41.8,13.54 ; 60.34,13.07 60.32,13.06 60.32,11.04 60.96,10.4 v1(61.34,10.4)
  Top Layer w0.508: v1(24.26,28.85) 24.28,28.82 28.96,28.82 29.46,28.31 29.46,23.1 30.63,21.94 39.6,21.94 40.51,21.02 40.51,14.09 41.06,13.54 49.06,13.54 49.53,13.07 52.21,13.07 52.23,13.08 58.26,13.08 58.28,13.07 61.74,13.07 61.75,13.08 96.62,13.08 96.63,13.07 99.06,13.07 99.77,12.36 v5(99.77,11.19)
  Bottom Layer w0.381: R21.2 52.4,10.08 v1(51.94,10.53) ; v5(90.56,10.53) 90.63,10.46 R5.2 ; 71.58,9.52 71.58,10.34 v5(71.64,10.4) ; v5(99.77,11.19) 99.77,10.02 R1.2 ; 81.23,9.52 v5(81.23,10.4) ; R25.2 v1(43.13,10.4) ; v1(61.34,10.4) 61.34,9.97 R17.2
  Bottom Layer w0.508: v1(24.26,28.85) 20.5,32.6 20.5,44.64 18.92,46.22 13.33,46.22 v1(10.4,49.16) 9.61,49.94 C40.2 8.09,49.94 7.69,50.34 U17.2
B+: length 24
  Top Layer w0.508: H3.2 34.77,11.29 ; H3.2 37.08,11.29 arc(37.53,11.11) 37.72,10.66 37.72,10.38 arc(37.52,9.89) 37.03,9.69 34.9,9.69 arc(34.52,9.54) 34.37,9.16 34.37,8.68 arc(34.54,8.26) 34.95,8.09 38.58,8.09 arc(38.87,7.97) 38.99,7.69 38.99,7.18 arc(38.88,6.91) 38.61,6.8 37.77,6.8 arc(37.19,6.56) 36.95,5.98 CN2.2 ; H3.2 34.77,11.33 34.77,15.38 35.38,15.99 U15.6
B-: length 23.9
  Top Layer w0.508: U15.7 34.29,17.26 33.63,16.6 33.63,13.99 33.1,13.45 31.11,13.45 30.61,12.94 30.61,6.09 31.62,5.07 CN2.1
  Bottom Layer w0.508: 33.51,8.88 33.54,8.88 ; 33.51,8.88 33.44,8.88 R89.2 ; 33.51,8.88 33.43,8.8 33.43,5.1 CN2.1
BB_BLINK: length 105.2
  Top Layer w0.381: U44.1 112.05,51.93 R104.1 111.72,51.42 111.53,51.22 97.19,51.22 97.16,51.26 ; 97.16,51.26 97.16,28.82 95.12,26.79 CN3.16 93.6,28.31 93.22,28.69 v1(75.18,28.69) ; 97.16,51.26 97.16,59.55 93.98,62.73
  Inner1 w0.381: CN4.16 49.15,27.04 50.8,28.69 v1(75.18,28.69)
BB_OC1: length 58.5
  Inner2 w0.305: v1(65.79,54.47) 73.8,46.46 73.8,23.1 74.18,22.72 85.47,22.72 88.01,20.18 88.01,18.53 87.63,18.15 87.63,15.61 P8.15
  Bottom Layer w0.381: v1(65.79,54.47) 63.95,54.47
BB_OC2: length 53.5
  Inner2 w0.305: P8.18 85.34,17.9 85.34,21.07 84.71,21.71 73.15,21.71 71.37,23.49 71.37,47.72 65.89,53.2 v1(65.79,53.2)
  Bottom Layer w0.381: v1(65.79,53.2) 63.95,53.2
BB_OC3: length 55.2
  Inner2 w0.305: v1(65.79,51.93) 65.81,51.93 70.61,47.13 70.61,23.1 73.03,20.69 82.42,20.69 82.8,20.31 82.8,18.66 82.58,18.43 82.58,15.84 82.8,15.61 85.47,15.61 86.36,14.72 P8.17
  Bottom Layer w0.381: v1(65.79,51.93) 63.95,51.93
BB_OC4: length 45.1
  Inner2 w0.305: 76.2,14.34 74.93,15.61 70.36,15.61 69.85,16.12 69.85,46.47 65.79,50.54 v1(65.79,50.66)
  Bottom Layer w0.381: v1(65.79,50.66) 63.95,50.66
BB_RL_P1: length 16.9
  Top Layer w0.305: 93.98,16.88 92.33,18.53 92.33,20.06 91.57,20.82 87.12,20.82 84.71,23.23 84.71,25.52 CN3.8
BB_RL_P2: length 20.1
  Top Layer w0.305: CN3.10 87.25,25.52 87.25,22.09 87.88,21.45 93.47,21.45 94.87,20.06 94.87,18.02 95.25,17.64 95.25,15.61 93.98,14.34
BB_RL_P3: length 13.7
  Inner2 w0.305: P8.13 90.15,15.64 90.15,17.8 89.79,18.15 89.79,25.52 CN3.12
BB_RL_P4: length 16.9
  Inner2 w0.305: CN3.14 91.06,27.93 90.68,28.31 87.76,28.31 87.25,27.8 87.25,22.34 88.9,20.69 P8.16
BB_RL_P5: length 83.6
  Inner2 w0.305: P8.8 100.33,15.61 100.33,13.2 99.06,11.93 99.06,8.27 98.28,7.48 55.75,7.48 53.85,9.39 53.85,12.44 53.21,13.07 52.58,13.07 52.07,13.58 52.07,17.77 49.15,20.69 42.8,20.69 40.26,23.23 40.26,25.52 CN4.8
BB_RL_P6: length 77.4
  Inner2 w0.305: P8.7 98.93,14.34 98.43,13.83 98.43,9.39 97.28,8.25 57.78,8.25 56.39,9.64 56.39,12.31 55.63,13.07 54.86,13.07 54.48,13.45 54.48,17.9 53.85,18.53 53.85,20.31 52.83,21.33 43.81,21.33 42.8,22.34 42.8,25.39 41.53,26.66 CN4.10
BB_RL_P7: length 75.1
  Inner2 w0.305: CN4.12 44.07,26.66 45.34,25.39 45.34,22.47 45.72,22.09 55.37,22.09 56.51,20.95 56.51,18.53 57.15,17.9 57.15,13.71 57.78,13.07 67.94,13.07 68.83,12.18 68.83,11.17 70.99,9.01 96.65,9.01 97.79,10.15 97.79,15.61 P8.10
BB_RL_P8: length 66.2
  Inner2 w0.305: P8.9 94.87,12.69 94.87,10.79 93.73,9.64 73.66,9.64 73.15,10.15 73.15,12.18 72.26,13.07 70.23,13.07 69.85,13.45 69.85,14.85 69.09,15.61 67.8,15.61 67.18,16.22 67.18,17.9 66.17,18.91 66.17,22.09 65.41,22.85 48.39,22.85 47.88,23.36 47.88,25.52 CN4.14
COM: length 128.5
  Top Layer w0.254: U44.3 115.94,50.96 v1(115.98,50.92)
  Top Layer w0.381: U43.17 21.14,25.73 U43.9 21.29,26.64 v1(22.2,26.64)
  Top Layer w0.508: U15.5 38.76,14.72 39.25,15.21 39.25,20.66 38.89,21.02 34.42,21.02 v1(33.76,20.36) 33.76,18.23 32.79,17.26 U15.2 ; C49.1 18.48,28.45 19,27.93 ; SW5.5 SW5.4 ; SW4.5 SW4.4 ; C48.1 C50.1 25.72,26.66 27.94,26.66 28.12,26.48 R103.1 28.11,25.63 C62.1 28.11,22.29 D20.2 ; 14.43,26.41 14.43,24.97 C57.1 14.34,23.71 D15.2 v1(12.78,23.36) ; SW7.5 SW7.4 ; SW6.5 SW6.4
  Bottom Layer w0.254: R101.1 23.65,25.4 C61.1 ; D6.2 C6.1 ; C42.1 C46.1 C41.1 C47.1
  Bottom Layer w0.381: U2.2 93.76,41.9 v1(93.11,41.9) 92.11,41.9 92.13,41.91 R29.1 ; 66.77,59.51 C43.1 C45.1 C42.1 ; 66.77,59.51 C44.1 ; 66.77,59.51 66.77,60.85 66.04,61.59 66.04,62.73 ; 77.42,36.43 R39.1 ; 77.42,36.43 C10.1 ; 77.42,36.43 77.27,36.28 U4.2 ; R75.1 5.7,38.02 C39.1 C23.1 8.14,38 v1(8.15,38.01) ; C5.1 D5.2 ; U3.2 95.9,35.82 95.9,34.93 95.63,34.66 92.51,34.66 R34.1 92.25,36.3 C9.1 ; U5.2 73.6,43.24 73.91,43.55 76.95,43.55 R44.1 77.43,43.07 C11.1 ; 94.4,7.86 D2.2 ; C3.1 D3.2 ; 104.05,7.61 D1.2 ; C4.1 D4.2 ; C7.1 D7.2
  Bottom Layer w0.508: R95.1 14.3,25.53 C58.1 14.31,23.69 D15.2 v1(12.78,23.36) ; U17.3 7.26,49.1 C40.1 ; 20.27,27.42 20.27,25.55 C60.1 v1(20.23,24.53) 20.23,23.51 D18.2 19.95,23.07 v1(19.38,22.5) ; 26.8,64.84 28.09,64.84 ; R97.1 17.35,25.53 C59.1 17.36,23.69 D17.2 16.38,22.71 v1(16.38,22.65) ; U13.5 26,59.06 v1(28,59.06) 28.68,59.06 28.7,59.05 28.87,59.05 C37.1
  Bottom Layer w0.635: P9.1 106.68,60.76 105.86,59.93 105.86,58.44 105.58,58.16
  Bottom Layer w1.27: P9.2 P9.1
  vias: v1(2.41,30.17) v1(2.92,51.46) v1(3.05,47.44) v1(6.71,61.76) v1(6.71,60.37) v1(7.29,56.43) v1(8.08,47.74) v1(8.09,35.05) v1(12.06,51.48) v1(13.51,67.76) v1(16.84,66.18) v1(18.26,43.64) v1(18.26,33.93) v1(18.48,28.7) v1(19.43,51.53) v1(22.43,43.98) v1(24.33,43.98) v1(28.09,64.84) v1(28.42,42.99) v1(28.45,45.05) v1(40.59,41.8) v1(45.42,37.63) v1(46.46,30.17) v1(46.74,45.58) v1(46.84,54.32) v1(49.96,34.38) v1(50.08,42.79) v1(54.41,38.4) v1(62.43,53.88) v1(62.43,51.32) v1(72.04,59.93) v1(72.42,42.33) v1(73,52.67) v1(73.74,59.91) v1(75.84,45.11) v1(76.02,52.62) v1(76.1,34.79) v1(78.89,52.54) v1(79.88,39.13) v1(81.84,52.62) v1(86.46,33.59) v1(87.99,60.67) v1(88.19,53.66) v1(88.24,49.98) v1(91.49,53.71) v1(91.49,50.08) v1(91.67,39.13) v1(93.6,33.24) v1(101.3,60.44) v5(56.17,6.45) v5(74.66,5.94) v5(106.77,6.34)
EARTH_COM: length 48.7
  Bottom Layer w0.762: v4(32.91,43.71) D9.1 ; J2.1 101.73,24.5 104.39,21.83 108.59,21.83 109.35,21.07 109.35,10.15 109.6,9.9 D13.1 ; D8.1 32.91,36.94 v4(32.77,37.07) ; v4(32.91,62.88) D11.1 ; D10.1 v4(32.91,56.46)
  Bottom Layer w1.27: 57.28,39.23 J4.1 ; J1.1 J1.1
  vias: v1(31.17,38.9) v1(33.55,38.9) v1(36.01,38.9) v1(38.41,38.9)
EN_485: length 71.8
  Bottom Layer w0.381: P9.17 86.23,62.73 85.09,63.87 85.09,66.44 84.71,66.82 22.25,66.82 21.23,65.8 U12.2
ENABLE: length 175.6
  Top Layer w0.381: R106.1 111.66,54.35 v1(112.55,54.35) 114.64,54.35
  Bottom Layer w0.381: 5.63,26.19 v1(5.59,26.15) 5.46,26.03 1.83,26.03 1.4,26.46 1.4,63.29 2.16,64.05 11.58,64.05 11.96,64.43 11.96,68.29 12.55,68.88 110.44,68.88 112.4,66.92 112.4,54.51 v1(112.55,54.35)
  Bottom Layer w0.508: 5.63,26.19 U10.3 ; v1(5.59,26.15) 5.59,25.07 arc(5.61,25.03) 5.65,25.01
I2C2_SCL: length 130.1
  Top Layer w0.305: v1(20.07,46.73) 18.29,46.73 17.02,45.46 17.02,26.28 17.56,25.73 U43.13
  Top Layer w0.381: 83.82,65.27 85.09,64 85.09,49.27 83.57,47.74 21.08,47.74 v1(20.07,46.73)
  Bottom Layer w0.305: v1(20.07,46.73) 19.18,47.62 14.1,47.62 10.16,51.55 9.45,51.55 7.16,53.84 5.83,53.84
  Bottom Layer w0.381: 83.82,65.27 82.55,64 R77.1
I2C2_SDA: length 121.1
  Top Layer w0.305: U43.14 17.17,25.24 16.51,25.9 16.51,46.88 v1(16.46,46.93)
  Top Layer w0.381: v1(16.46,46.93) 18.01,48.48 82.91,48.48 83.82,49.39 83.82,62.73
  Bottom Layer w0.305: v1(16.46,46.93) 13.77,46.93 9.78,50.92 8.94,50.92 7.29,52.57 5.83,52.57
  Bottom Layer w0.381: 83.82,62.73 84.58,61.97 R78.1
IN1: length 2.8
  Top Layer w0.508: R92.2 15.49,20.44 17.27,18.66
IN2: length 5.8
  Top Layer w0.508: R94.2 18.54,19.75 U42.3
IN3: length 2.2
  Top Layer w0.508: 19.81,18.66 19.56,18.91 R96.2
IN4: length 5.6
  Top Layer w0.508: U42.5 21.08,20.26 R98.2
IN5: length 2.7
  Top Layer w0.508: R100.2 22.35,19.37 22.35,18.66
IN6: length 6.7
  Top Layer w0.508: U42.7 23.62,19.29 25.09,20.77 R102.2
MS_SWCLK: length 3
  Top Layer w0.381: H4.4 115.28,55.12 115.28,54.35
MS_SWDIO: length 2.5
  Top Layer w0.381: H4.3 115.94,56.39 115.94,54.35
NRST: length 14.9
  Top Layer w0.381: U44.2 115.28,49.96 v1(115.61,49.64) ; R105.1 v1(115.61,49.64) ; v1(115.61,49.64) 115.47,49.64 115.4,49.71 C63.1
  Bottom Layer w0.381: v1(115.61,49.64) 112.41,49.64 111.15,50.89 111.15,56.68 H4.5
PWM1: length 26.3
  Top Layer w0.381: v1(95.68,39.36) 95.68,58.49 P9.13
  Bottom Layer w0.381: R31.1 v1(95.68,39.36)
PWM2: length 27.9
  Top Layer w0.381: v1(95.25,38.6) 95,38.6 94.62,38.98 94.62,57.01 P9.15
  Bottom Layer w0.381: R36.1 95.3,38.55 v1(95.25,38.6)
PWM3: length 33.6
  Top Layer w0.381: 83.82,16.88 83.57,16.88 82.68,17.77 82.68,20.44 82.17,20.95 73.11,20.95 72.14,21.92 v1(72.14,37.83)
  Bottom Layer w0.381: v1(72.14,37.83) 74.49,37.83 R41.1
PWM4: length 40.8
  Top Layer w0.381: P8.14 90.17,18.15 85.85,18.15 85.22,18.79 85.22,20.32 83.58,21.96 73.79,21.96 73.15,22.6 73.15,40 v1(72.77,40.38)
  Bottom Layer w0.381: v1(72.77,40.38) 74.12,40.38
T1: length 64
  Inner2 w0.762: v2(34.05,31.57) 33.86,31.76 30.75,31.76 29.53,30.53 29.53,23.04 35.03,17.54 38.84,17.54 41.85,14.53 48.36,14.53 50.48,12.41 50.48,10.21 54.65,6.05 54.65,5.26 CN2.7
  Bottom Layer w1.016: D8.2 33.56,31.58 C12.2 36.22,31.58 TR1.4 TR1.2 45.6,33.8 47.73,35.93
T1_LED: length 49.8
  Top Layer w0.381: v1(54.1,31.74) 54.99,30.85 67.69,30.85 68.59,29.95 R49.1
  Bottom Layer w0.381: v1(54.1,31.74) 54.1,33.37 ; U6.2 55.37,34.64 55.37,40.88 56.39,41.9 60.83,41.9 61.54,42.61 61.54,53.76 60.83,54.47 U40.16
T2: length 74.4
  Inner2 w0.762: v2(34.02,40.98) 29.21,40.98 28.32,40.09 28.32,21.83 28.5,21.83 34.06,16.27 38.46,16.27 39.88,14.85 39.88,10.46 40.84,9.49 48.03,9.49 50.83,6.69 50.83,5.2 CN2.6
  Bottom Layer w1.016: D9.2 33.68,40.98 C13.2 37.18,40.98 38.44,42.24 TR2.4 TR2.2 47.25,43.46 U7.4 47.43,43.81
T2_LED: length 44.5
  Top Layer w0.381: R54.1 64.14,28.94 63.25,29.84 54.23,29.84 53.21,30.85 v1(53.21,39.87)
  Bottom Layer w0.381: U40.15 60.07,53.2 60.83,52.44 60.83,43.3 60.2,42.66 55.94,42.66 54.54,41.27 54,41.27 53.21,40.48 v1(53.21,39.87)
T3: length 85.3
  Inner2 w0.762: v2(33.81,50.5) 28.54,50.5 27.05,49.01 27.05,20.95 33.12,14.88 37.72,14.88 38.48,14.11 38.48,9.11 39.19,8.4 46.33,8.4 47.52,7.21 47.52,5.14 CN2.5
  Bottom Layer w1.016: 47.78,51.43 47.86,51.51 47.86,52.08 46.83,53.11 TR3.2 TR3.4 38.44,51.26 37.69,50.5 C14.2 v2(33.81,50.5) D10.2
T3_LED: length 44
  Top Layer w0.381: v1(56.13,44.31) 55.12,44.31 52.45,41.65 52.45,30.09 53.85,28.69 58.55,28.69 59.44,27.8 R59.1
  Bottom Layer w0.381: U8.2 54.13,46.32 v1(56.13,44.31) 59.82,44.31 60.2,44.69 60.2,51.55 59.82,51.93 U40.14
T4: length 95.5
  Inner2 w0.762: CN2.4 43.96,6.56 43.33,7.18 37.77,7.18 37.21,7.74 37.21,12.69 36.6,13.3 32.28,13.3 28,17.59 arc(27.94,17.65) 27.88,17.7 25.65,19.93 25.65,58.92 27.13,60.39 33.45,60.39 v2(33.81,60.03)
  Bottom Layer w1.016: D11.2 v2(33.81,60.03) C15.2 37.81,60.03 38.57,60.78 TR4.4 TR4.2 46.45,62.51 47.6,61.36 U9.4
T4_LED: length 38.6
  Top Layer w0.381: 54.75,26.41 54.11,27.04 53.09,27.04 51.46,28.68 51.46,42.81 v1(55.39,46.74)
  Bottom Layer w0.381: 55.39,50.66 55.39,56.76 55.01,57.14 54.13,57.14 U9.2 ; 55.39,50.66 v1(55.39,46.74) ; 55.39,50.66 U40.13
UA1: length 116.2
  Top Layer w0.381: 58.42,65.27 59.69,64 v1(59.69,58.03)
  Bottom Layer w0.381: 105.15,8.63 105.27,8.75 105.27,10.67 104.9,11.04 104.9,12.69 105.54,13.33 105.54,17.9 104.65,18.79 104.65,20.31 104.14,20.82 100.84,20.82 99.19,22.47 99.19,56.25 97.41,58.03 v1(59.69,58.03) ; 105.15,8.63 107.19,8.63 107.53,8.28 D1.1 ; 105.15,8.63 103.2,8.63 ; 103.2,8.63 103.21,8.61 103.21,7.61 ; 103.2,8.63 R3.1 ; 103.2,8.63 101.22,8.63 101.02,8.42 R2.1 ; C41.2 59.69,64 58.42,65.27
UA2: length 105.4
  Top Layer w0.381: v1(58.42,57.78) 58.42,62.73
  Bottom Layer w0.381: v1(58.42,57.78) 58.93,57.27 96.9,57.27 98.43,55.74 98.43,21.96 97.79,21.33 97.79,13.58 98.04,13.33 98.04,8.75 97.92,8.63 97.54,8.63 ; 93.55,8.63 91.69,8.63 91.49,8.42 R6.1 ; 93.55,8.63 93.42,8.75 R7.1 ; 93.55,8.63 93.56,8.61 C2.2 ; 93.55,8.63 97.54,8.63 ; D2.1 97.52,8.61 97.54,8.63 ; C47.2 58.04,62.35 58.42,62.73
UA3: length 114.6
  Top Layer w0.381: v1(62.74,56.51) 62.23,57.01 62.23,64 P9.38
  Bottom Layer w0.381: C42.2 62.23,60.99 62.23,64 P9.38 ; 87.36,8.65 88.03,8.65 88.39,9.01 88.39,11.57 89.38,12.56 89.41,12.56 90.17,13.33 90.17,17.9 89.53,18.53 89.53,20.44 90.04,20.95 96.27,20.95 97.79,22.47 97.79,54.85 96.14,56.51 v1(62.74,56.51) ; 87.36,8.65 83.77,8.65 ; 87.36,8.65 87.75,8.26 D3.1 ; 83.77,8.65 83.75,8.63 82.17,8.63 81.97,8.42 R10.1 ; 83.77,8.65 83.77,7.88 C3.2 ; 83.77,8.65 83.77,9.52
UA4: length 98.4
  Top Layer w0.381: P9.37 61.18,62.5 v1(61.18,55.74)
  Bottom Layer w0.381: 74.13,8.71 74.26,8.83 75.83,8.83 ; 74.13,8.71 74.13,9.5 74.12,9.52 ; 74.13,8.71 72.85,8.71 72.44,8.3 72.44,7.99 ; 74.13,8.71 C4.2 ; C46.2 61.21,62.47 P9.37 ; 75.83,8.83 75.83,10.52 75.56,10.79 75.56,12.69 74.93,13.33 74.93,17.9 75.56,18.53 75.56,20.56 73.41,22.72 73.41,28.18 75.44,30.22 83.82,30.22 84.33,30.72 84.33,54.85 83.44,55.74 v1(61.18,55.74) ; 75.83,8.83 77.77,8.83 78.09,8.51 D4.1
UA5: length 74.1
  Top Layer w0.381: v1(69.47,54.85) 67.31,57.01 67.31,64 66.04,65.27
  Bottom Layer w0.381: C5.2 64.34,8 64.34,8.76 ; 66.04,65.27 67.31,64 67.31,60.61 C44.2 ; v1(69.47,54.85) 69.47,44.82 66.04,41.39 66.04,18.79 64.9,17.64 64.9,13.45 66.09,12.26 66.09,8.76 ; 66.09,8.76 64.34,8.76 ; 66.09,8.76 67.81,8.76 68.19,8.38 D5.1 ; R19.1 64.34,8.76 ; 64.34,8.76 62.87,8.76 62.66,8.55 R18.1
UA6: length 74
  Top Layer w0.381: v1(68.71,52.83) 68.7,52.83 63.5,58.03 P9.35
  Bottom Layer w0.381: C45.2 63.5,61.37 P9.35 ; 55.07,8.7 55.07,8 C6.2 ; 55.07,8.7 R23.1 ; 55.07,8.7 53.93,8.7 53.34,8.12 R22.1 ; 55.07,8.7 55.12,8.75 58.37,8.75 58.92,8.21 D6.1 59.44,7.99 59.69,8.25 59.69,19.8 60.71,20.82 64.26,20.82 64.9,21.45 64.9,42.03 68.71,45.84 v1(68.71,52.83)
UA7: length 90.6
  Top Layer w0.381: P9.36 64.77,64 64.77,58.03 v1(67.94,54.85)
  Bottom Layer w0.254: C7.2 45.68,9.63 45.67,9.64
  Bottom Layer w0.381: 47.26,8.76 47.26,10.76 46.99,11.04 46.99,20.95 47.75,21.71 63.63,21.71 64.13,22.22 64.13,42.79 67.94,46.6 v1(67.94,54.85) ; 47.26,8.76 44.07,8.76 43.99,8.68 R26.1 ; 47.26,8.76 49.02,8.76 49.28,8.5 49.28,8 D7.1 ; C43.2 66.04,60.44 64.77,61.71 64.77,64 P9.36
UART1_RX: length 3.2
  Bottom Layer w0.381: 76.2,62.73 CN5.2
UART1_TX: length 3.2
  Bottom Layer w0.381: P9.23 CN5.1
UART2_RXD: length 86
  Top Layer w0.381: P9.21 80.01,64 80.01,66.16 79.38,66.79 21.46,66.79 20.7,66.03 v1(20.7,51.04)
  Bottom Layer w0.381: v1(20.7,51.04) 18.56,48.91 17.23,48.91
  Bottom Layer w0.508: R86.1 14.84,49.07 14.84,49.03 14.96,48.91 17.23,48.91
UART2_TXD: length 73.6
  Top Layer w0.381: P9.22 81.28,66.41 80.01,67.68 20.95,67.68 19.69,66.41 v1(19.69,59.43)
  Bottom Layer w0.381: v1(19.69,59.43) 16.87,59.43 U13.2
UI1: length 21.7
  Top Layer w0.381: CN1.10 v5(108.39,9.52) 108.39,10.6 108.2,10.79 102.62,10.79 101.47,11.93 SW1.1
  Bottom Layer w0.381: v5(108.39,9.52) R4.2 ; R2.2 99.82,7.61 98.81,8.63 98.81,11.55 99.19,11.93 SW1.1
UI2: length 26.5
  Top Layer w0.381: CN1.9 104.76,5.2 104.76,9.64 104.38,10.02 101.73,10.02 101.25,10.5 v5(97.19,10.5) 92.36,10.5 SW2.1
  Bottom Layer w0.381: v5(97.19,10.5) 97.19,9.54 R8.2 ; SW2.1 90.04,11.8 89.41,11.17 89.41,8.12 89.66,7.86 R6.2
UI3: length 30.9
  Top Layer w0.381: CN1.8 101.39,8.71 100.2,9.9 88.9,9.9 88.39,10.4 v5(87.5,10.4) 82.3,10.4 81.41,11.29 SW3.1
  Bottom Layer w0.381: R12.2 87.5,9.59 v5(87.5,10.4) ; SW3.1 80.86,11.8 80.6,11.55 80.6,8.25 80.86,7.99 R10.2
UI4: length 36.9
  Top Layer w0.381: CN1.7 97.89,8.65 97.28,9.26 80.14,9.26 79,10.4 78.99,10.4 78.99,10.4 73.15,10.4 SW4.1
  Bottom Layer w0.381: R16.2 77.78,10.33 v5(77.85,10.4) ; SW4.1 71.23,11.8 70.87,11.43 70.87,8.36 71.23,7.99 71.58,7.99
UI5: length 44.9
  Top Layer w0.381: SW5.1 62.23,10.15 62.87,9.52 v5(68.83,9.52) 78.49,9.52 79.46,8.54 94.07,8.54 94.52,8.09 94.52,5.2 CN1.6
  Bottom Layer w0.381: SW5.1 60.96,11.8 60.45,11.29 60.45,8.88 61.34,7.99 R18.2 ; v5(68.83,9.52) R20.2
UI6: length 48.5
  Top Layer w0.381: SW6.1 54.48,10.02 v5(58.55,10.02) 59.06,10.02 60.2,8.88 77.6,8.88 78.74,7.74 89.66,7.74 90.89,6.51 CN1.5
  Bottom Layer w0.381: R24.2 58.55,9.57 v5(58.55,10.02) ; R22.2 51.56,8.12 50.93,8.75 50.93,11.17 51.56,11.8 SW6.1
UI7: length 55.8
  Top Layer w0.381: SW7.1 44.58,10.4 v5(48.97,10.4) 49.78,10.4 51.18,9.01 57.91,9.01 59.18,7.74 77.17,7.74 77.93,6.98 87,6.98 87.39,6.58 CN1.4
  Bottom Layer w0.381: R26.2 41.53,8.12 41.28,8.37 41.28,11.55 41.53,11.8 SW7.1 ; v5(48.97,10.4) 48.97,9.67 R28.2
$1N2630: length 2.5
  Bottom Layer w0.381: R27.2 46.53,10.18 45.72,11 SW7.2
$1N2631: length 2.2
  Bottom Layer w0.381: SW7.3 48.08,11.62 R28.1
$1N2635: length 11.5
  Bottom Layer w0.381: R21.1 53.97,10.23 53.97,12.82 54.61,13.45 54.61,18.02 53.21,19.42 SW6.6
$1N2636: length 10.5
  Bottom Layer w0.381: SW7.6 44.45,18.15 44.45,10.1 R25.1
$1N2638: length 2.6
  Bottom Layer w0.381: SW4.2 74.29,10.74 74.98,10.05 R15.2
$1N2639: length 2.3
  Bottom Layer w0.381: SW4.3 76.91,11.73 R16.1
$1N2649: length 10.7
  Bottom Layer w0.381: 72.44,9.52 73.03,10.1 73.03,12.69 72.39,13.33 72.39,18.79 SW4.6
$1N2651: length 2.3
  Bottom Layer w0.381: R12.1 86.56,11.73 SW3.3
$1N2654: length 2.6
  Bottom Layer w0.381: R11.2 84.63,11.11 SW3.2
$1N2656: length 10.6
  Bottom Layer w0.381: SW3.6 81.41,18.79 82.55,17.64 82.55,9.97 R9.1
$1N2660: length 11.1
  Bottom Layer w0.381: SW2.6 92.71,17.77 92.71,13.33 92.33,12.94 92.33,10.35 R5.1
$1N2662: length 10.8
  Bottom Layer w0.381: SW5.6 62.23,13.58 63.5,12.31 63.5,10.35 R17.1
$1N2667: length 2.4
  Bottom Layer w0.381: SW2.3 96.14,9.72 R8.1
$1N2669: length 2.6
  Bottom Layer w0.381: SW1.2 104.06,11.37 R3.2
$1N2673: length 11.5
  Bottom Layer w0.381: R1.1 102.24,10.61 102.24,12.69 102.87,13.33 102.87,17.64 SW1.6
$1N2674: length 2.6
  Bottom Layer w0.381: R7.2 94.29,11.11 SW2.2
$1N2677: length 2.5
  Bottom Layer w0.381: R4.1 106.04,9.84 SW1.3
$1N2679: length 2.3
  Bottom Layer w0.381: R24.1 57.73,11.75 arc(57.75,11.79) SW6.3
$1N2680: length 2.6
  Bottom Layer w0.381: R23.2 55.93,11.11 SW6.2
$1N2683: length 2.4
  Bottom Layer w0.381: R20.1 67,11.5 SW5.3
$1N2684: length 2.5
  Bottom Layer w0.381: R19.2 65.2,11.37 SW5.2
$2N1158: length 5.3
  Bottom Layer w0.381: U1.10 R42.2 78.28,36.45 C10.2
$2N1160: length 5.9
  Bottom Layer w0.381: R40.1 78.28,33.76 R39.2 78.49,35.04 80.01,36.57 U1.9
$2N1161: length 4.4
  Bottom Layer w0.381: U4.1 74.39,36.28 75.36,37.25 R41.2 R42.1
$2N1164: length 6.6
  Bottom Layer w0.381: U1.8 82.22,32.42 81.91,32.12 R43.2
$2N1167: length 6.7
  Bottom Layer w0.381: U1.7 87.5,35.25 87.5,32.25 87.76,31.99 R38.2
$2N1168: length 5.1
  Bottom Layer w0.381: R32.1 R31.2 94.82,41.21 95.92,42.32 U2.1
$2N1169: length 5.3
  Bottom Layer w0.381: U1.3 91.13,40.38 R32.2 91.26,41.89 C8.2
$2N1170: length 5.8
  Bottom Layer w0.381: U1.2 88.52,41.65 90.17,43.3 R29.2 91.26,44.54 R30.1
$2N1175: length 6
  Bottom Layer w0.381: 91.39,33.52 91.39,34.92 90.55,34.92 88.9,36.57 U1.6
$2N1177: length 6.5
  Bottom Layer w0.381: U1.1 87.46,45.79 87.88,46.22 R33.2
$2N1179: length 5.4
  Bottom Layer w0.381: U1.5 91.26,37.84 91.4,37.7 C9.2
$2N1181: length 4.1
  Bottom Layer w0.381: R37.1 93.89,37.71 ; 93.89,37.71 93.92,37.68 U3.1 ; 93.89,37.71 94.31,37.71 94.44,37.58
$2N1556: length 4.4
  Bottom Layer w0.381: 75.51,40.38 75.5,40.38 U5.1 ; 75.51,40.38 R46.2 ; 75.51,40.38 R47.1
$2N1558: length 6.7
  Bottom Layer w0.381: U1.14 82.22,45.79 81.79,46.22 R48.2
$2N1560: length 6
  Bottom Layer w0.381: R45.1 78.28,43.17 R44.2 79.67,43.13 81.15,41.65 U1.13
$2N1561: length 5.3
  Bottom Layer w0.381: U1.12 R47.2 78.28,41.76 C11.2
$5N734: length 3.3
  Bottom Layer w0.508: 53.33,35.93 R50.1
  Bottom Layer w0.762: 54.13,35.93 53.33,35.93
$5N1044: length 9.1
  Bottom Layer w0.508: R51.2 49.27,31.5 TR1.3 44.64,29.39 44.32,29.07 R52.2
$5N1049: length 4.7
  Bottom Layer w0.508: R51.1 50.83,31.52 50.83,32.88 50.32,33.39 U6.3
$5N1081: length 2
  Bottom Layer w0.762: C12.1 35.32,34.96
$5N1545: length 2
  Bottom Layer w0.762: C13.1 35.32,44.35
$5N1559: length 5.4
  Bottom Layer w0.508: R56.1 51.68,39.61 51.68,40.76 51.23,41.22 47.9,41.22 47.85,41.27 47.6,41.27
$5N1561: length 10.8
  Bottom Layer w0.508: 50.17,39.61 48.9,39.61 47.91,38.63 44.64,38.63 ; R57.2 44.64,38.63 ; 44.64,38.63 TR2.3
$5N1574: length 3.8
  Bottom Layer w0.508: R55.1 53.47,45.46 54.23,44.69 54.23,43.83 54.25,43.81
$5N1956: length 2.5
  Bottom Layer w0.762: C14.1 R63.2
$5N1970: length 5.3
  Bottom Layer w0.508: R61.1 51.69,47.24 51.69,48.38 51.23,48.84 47.78,48.84 U8.3
$5N1972: length 10.9
  Bottom Layer w0.508: 44.62,48.28 R62.2 ; 44.62,48.28 44.64,48.3 TR3.3 ; 44.62,48.28 45.34,48.28 46.44,47.19 50.13,47.19 50.17,47.23
$5N1985: length 4.2
  Bottom Layer w0.508: R60.1 51.6,53.03 53.9,53.03 54.38,52.54 54.38,51.38
$5N2367: length 2.2
  Bottom Layer w0.762: C15.1 35.44,63.66
$5N2381: length 5.6
  Bottom Layer w0.508: 48.11,57.01 51.69,57.01 51.94,56.77 51.94,55.06
$5N2383: length 11.2
  Bottom Layer w0.508: R67.2 42.45,57.78 44.69,57.78 ; R66.2 50,55.06 47.55,55.06 44.83,57.78 44.69,57.78 ; TR4.3 44.77,57.85 44.69,57.78
$5N2396: length 2.5
  Bottom Layer w0.508: U9.1 54.51,59.55 55.01,60.05 R65.1
$5N3461: length 1.8
  Top Layer w0.508: 70.09,24.63 70.1,24.63 R49.2
$5N3567: length 1.8
  Top Layer w0.508: LED2.2 65.65,24.63 R54.2
$5N3676: length 1.8
  Top Layer w0.508: R59.2 60.95,24.63 60.95,24.63
$5N3780: length 1.8
  Top Layer w0.508: LED4.2 56.25,24.63 R64.2
$7N308: length 2.8
  Bottom Layer w1.27: R71.2 121.21,12.31 F1.1
$7N1267: length 4.2
  Bottom Layer w0.508: U10.1 9.56,27.33 9.78,27.55 C22.2
$7N1272: length 8.6
  Bottom Layer w0.508: U10.8 9.46,33.33 9.78,33.01 C22.1 14.4,30.89 14.5,30.79
$7N1516: length 5.2
  Bottom Layer w0.381: R74.1 2.96,37.15 R75.2
  Bottom Layer w0.508: R75.2 4.36,37.11 U10.5
$7N1806: length 4
  Bottom Layer w0.508: C39.2 5.72,35.75 R73.2 5.63,35.26 U10.6
$7N1822: length 1.7
  Bottom Layer w0.508: R73.1 7.11,35.88 C23.2
$7N2176: length 2.1
  Bottom Layer w0.508: R72.2 2.71,27.33 U10.4
$7N7163: length 2.3
  Bottom Layer w0.381: LED5.2 R76.2
$8N9460: length 39.8
  Top Layer w0.254: S1.3 S1.4
  Top Layer w0.381: P9.16 88.9,66.03 arc(89.12,66.57) 89.66,66.79 108.84,66.79 arc(109.56,66.49) 109.85,65.78 109.85,61.2 arc(110.08,60.67) 110.62,60.44 113.27,60.44 arc(113.29,60.45) S1.3
